# EAGLE design A500+ 2MB (EAGLE 7.6.0)
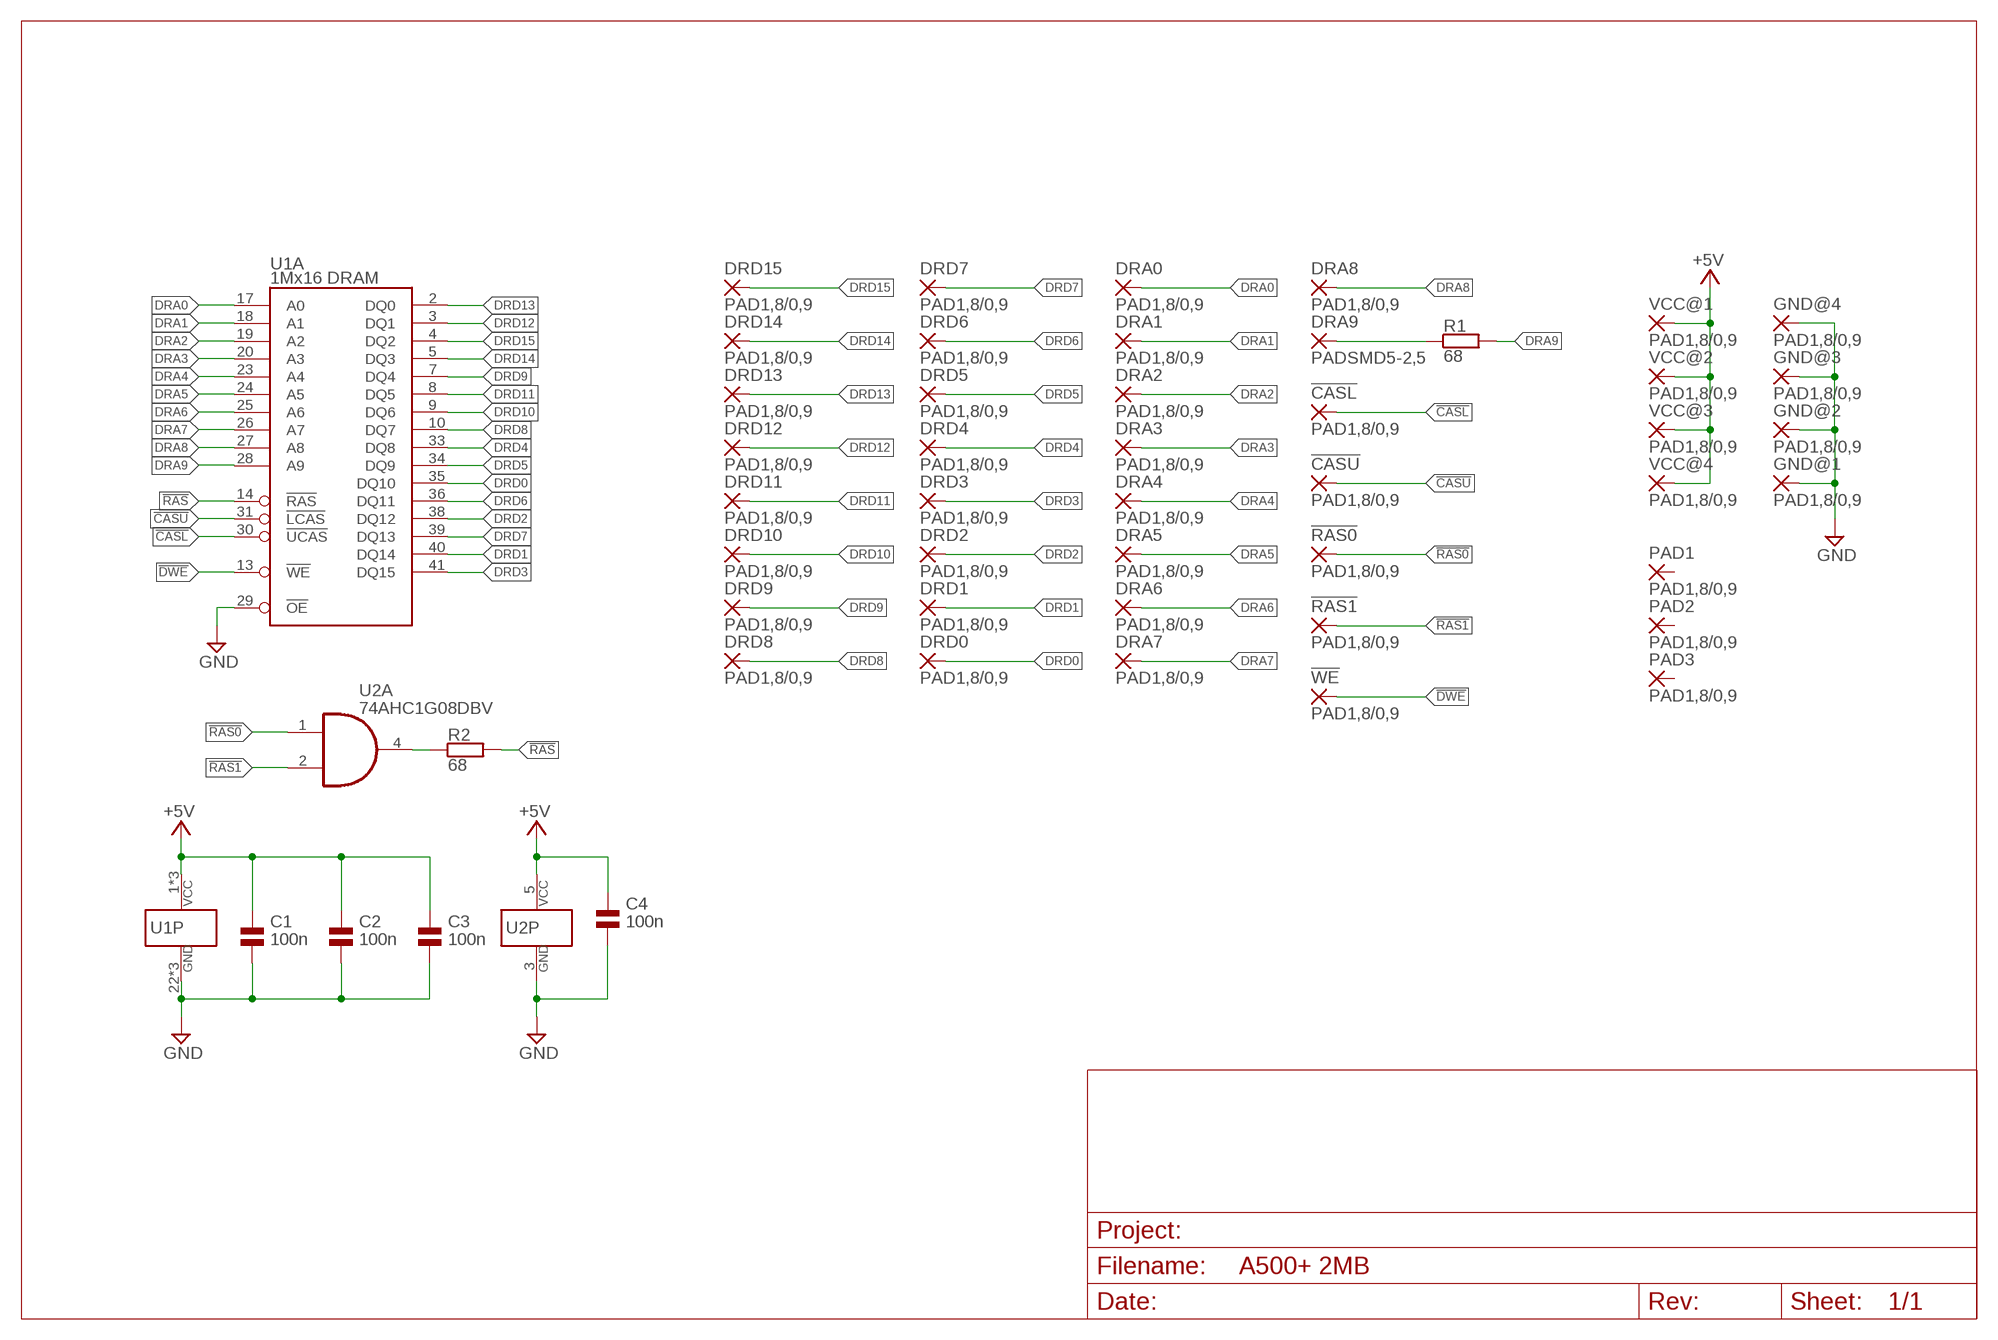
[diagram p0: schematic, sheet 1]

## Parts
!CASL  PAD1,8/0,9  [1,8/0,9]
!CASU  PAD1,8/0,9  [1,8/0,9]
!RAS0  PAD1,8/0,9  [1,8/0,9]
!RAS1  PAD1,8/0,9  [1,8/0,9]
!WE  PAD1,8/0,9  [1,8/0,9]
C1  100n  CAP_NPOL-0603  [0603]
C2  100n  CAP_NPOL-0603  [0603]
C3  100n  CAP_NPOL-0603  [0603]
C4  100n  CAP_NPOL-0603  [0603]
DRA0  PAD1,8/0,9  [1,8/0,9]
DRA1  PAD1,8/0,9  [1,8/0,9]
DRA2  PAD1,8/0,9  [1,8/0,9]
DRA3  PAD1,8/0,9  [1,8/0,9]
DRA4  PAD1,8/0,9  [1,8/0,9]
DRA5  PAD1,8/0,9  [1,8/0,9]
DRA6  PAD1,8/0,9  [1,8/0,9]
DRA7  PAD1,8/0,9  [1,8/0,9]
DRA8  PAD1,8/0,9  [1,8/0,9]
DRA9  PADSMD5-2,5  [5-2,5]
DRD0  PAD1,8/0,9  [1,8/0,9]
DRD1  PAD1,8/0,9  [1,8/0,9]
DRD2  PAD1,8/0,9  [1,8/0,9]
DRD3  PAD1,8/0,9  [1,8/0,9]
DRD4  PAD1,8/0,9  [1,8/0,9]
DRD5  PAD1,8/0,9  [1,8/0,9]
DRD6  PAD1,8/0,9  [1,8/0,9]
DRD7  PAD1,8/0,9  [1,8/0,9]
DRD8  PAD1,8/0,9  [1,8/0,9]
DRD9  PAD1,8/0,9  [1,8/0,9]
DRD10  PAD1,8/0,9  [1,8/0,9]
DRD11  PAD1,8/0,9  [1,8/0,9]
DRD12  PAD1,8/0,9  [1,8/0,9]
DRD13  PAD1,8/0,9  [1,8/0,9]
DRD14  PAD1,8/0,9  [1,8/0,9]
DRD15  PAD1,8/0,9  [1,8/0,9]
GND@1  PAD1,8/0,9  [1,8/0,9]
GND@2  PAD1,8/0,9  [1,8/0,9]
GND@3  PAD1,8/0,9  [1,8/0,9]
GND@4  PAD1,8/0,9  [1,8/0,9]
PAD1  PAD1,8/0,9  [1,8/0,9]
PAD2  PAD1,8/0,9  [1,8/0,9]
PAD3  PAD1,8/0,9  [1,8/0,9]
R1  68  RES-SMD_0603  [0603]
R2  68  RES-SMD_0603  [0603]
U1  1Mx16 DRAM  DRAM_1MX16-SOJ  [SOJ42/4]
U2  74AHC1G08DBV  [SOT23-5]
VCC@1  PAD1,8/0,9  [1,8/0,9]
VCC@2  PAD1,8/0,9  [1,8/0,9]
VCC@3  PAD1,8/0,9  [1,8/0,9]
VCC@4  PAD1,8/0,9  [1,8/0,9]

## Nets
!CASL: !CASL.1(P) U1.30(A:!UCAS)
!CASU: !CASU.1(P) U1.31(A:!LCAS)
!DWE: !WE.1(P) U1.13(A:!WE)
!RAS: R2.2 U1.14(A:!RAS)
!RAS0: !RAS0.1(P) U2.1(A:I0)
!RAS1: !RAS1.1(P) U2.2(A:I1)
+5V: C1.1 C2.1 C3.1 C4.1 U1.1(P:VCC) U1.6(P:VCC) U1.21(P:VCC) U2.5(P:VCC) VCC@1.1(P) VCC@2.1(P) VCC@3.1(P) VCC@4.1(P)
DRA0: DRA0.1(P) U1.17(A:A0)
DRA1: DRA1.1(P) U1.18(A:A1)
DRA2: DRA2.1(P) U1.19(A:A2)
DRA3: DRA3.1(P) U1.20(A:A3)
DRA4: DRA4.1(P) U1.23(A:A4)
DRA5: DRA5.1(P) U1.24(A:A5)
DRA6: DRA6.1(P) U1.25(A:A6)
DRA7: DRA7.1(P) U1.26(A:A7)
DRA8: DRA8.1(P) U1.27(A:A8)
DRA9: R1.2 U1.28(A:A9)
DRA9_: DRA9.1(P) R1.1
DRD0: DRD0.1(P) U1.35(A:DQ10)
DRD1: DRD1.1(P) U1.40(A:DQ14)
DRD2: DRD2.1(P) U1.38(A:DQ12)
DRD3: DRD3.1(P) U1.41(A:DQ15)
DRD4: DRD4.1(P) U1.33(A:DQ8)
DRD5: DRD5.1(P) U1.34(A:DQ9)
DRD6: DRD6.1(P) U1.36(A:DQ11)
DRD7: DRD7.1(P) U1.39(A:DQ13)
DRD8: DRD8.1(P) U1.10(A:DQ7)
DRD9: DRD9.1(P) U1.7(A:DQ4)
DRD10: DRD10.1(P) U1.9(A:DQ6)
DRD11: DRD11.1(P) U1.8(A:DQ5)
DRD12: DRD12.1(P) U1.3(A:DQ1)
DRD13: DRD13.1(P) U1.2(A:DQ0)
DRD14: DRD14.1(P) U1.5(A:DQ3)
DRD15: DRD15.1(P) U1.4(A:DQ2)
GND: C1.2 C2.2 C3.2 C4.2 GND@1.1(P) GND@2.1(P) GND@3.1(P) GND@4.1(P) U1.22(P:GND) U1.29(A:!OE) U1.37(P:GND) U1.42(P:GND) U2.3(P:GND)
N$1: R2.1 U2.4(A:O)
Unconnected: PAD1.1(P) PAD2.1(P) PAD3.1(P)

## Library data of the parts
!CASL !CASU !RAS0 !RAS1 !WE DRA0 DRA1-DRA9 DRD0 DRD1-DRD15 GND@1-GND@4 PAD1-PAD3 VCC@1-VCC@4 = jc-connectors:PAD: Wire PAD connect wire on PCB
C1-C4 = jc-passive:CAP_NPOL
R1 R2 = jc-passive:RES
U1 = jc-memories:DRAM_1MX16
U2 = jc-logic:74*1G08

## Board
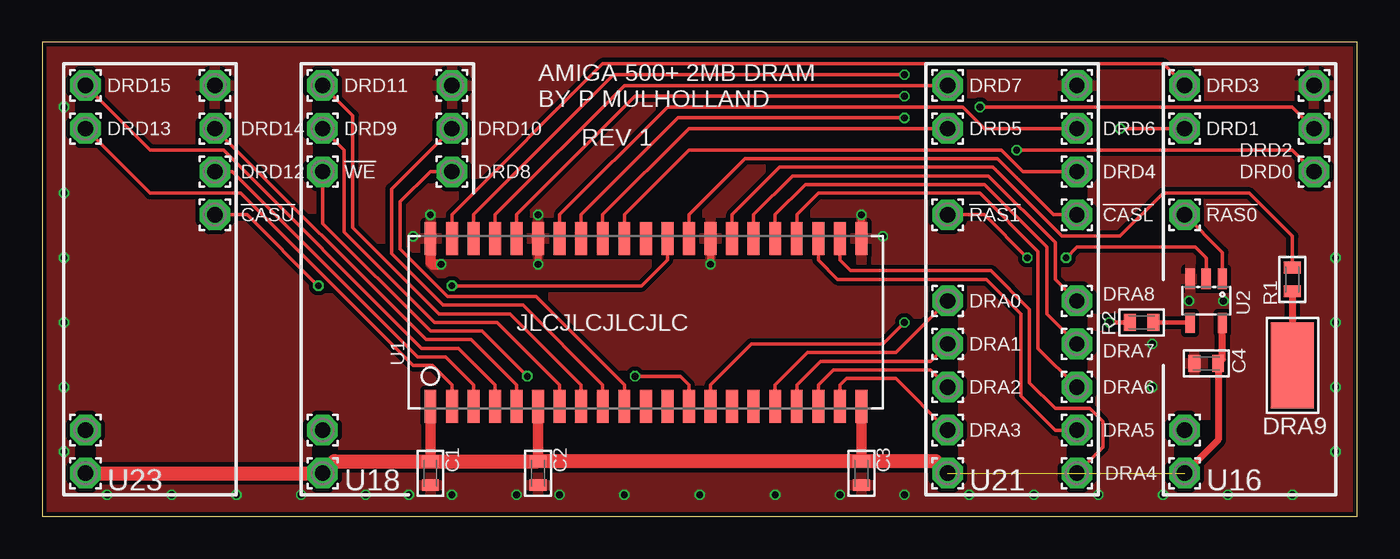
[diagram p1: board, top side]
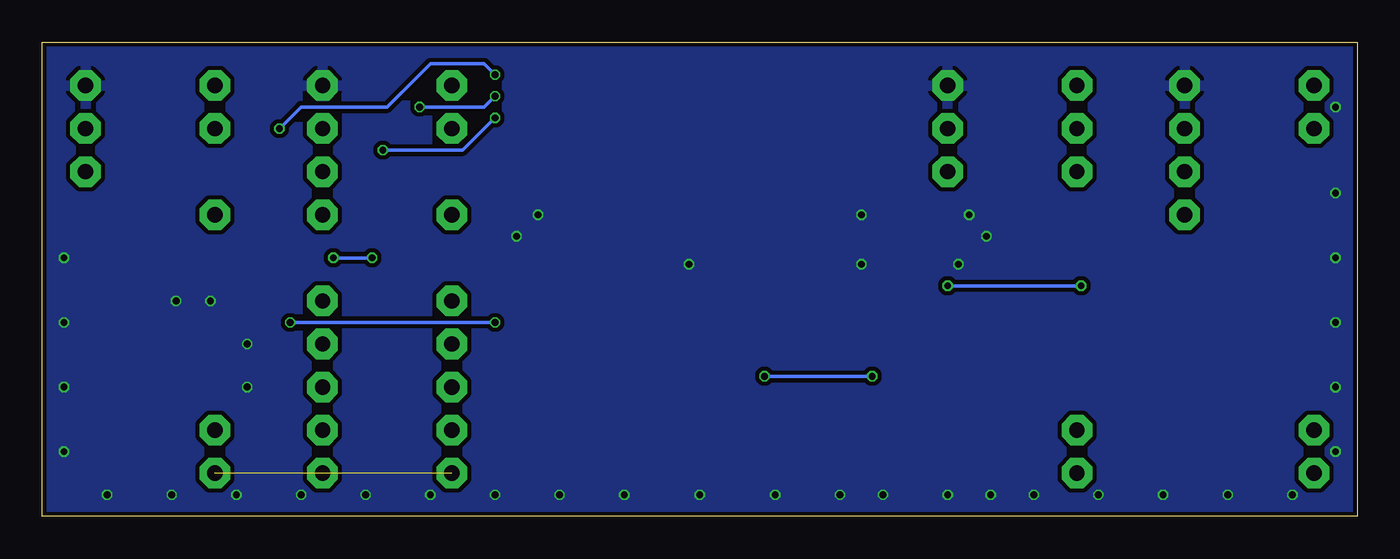
[diagram p2: board, bottom side, seen from below]

Size 77.47 x 27.94 mm. Coordinates in mm from the lower left corner, seen from the top.
Outline: 0,0 77.47,0 77.47,27.94 0,27.94 0,0
Copper layers (1*16): Top 0.035mm / dielectric 0.2mm / Bottom 0.035mm
Design rules "jlcpcb-2layers": minimum track width 3.5mil, minimum drill 0.2mm, track to track 5mil, track to pad 5mil, pad to pad 5mil, via to via 5mil, smd to smd 0mil, copper to edge 0.1mm, drill to drill 5mil, minimum pad ring 4mil, minimum via ring 4mil, stop-mask expansion 3mil, vias tented up to drill 100mil, thermal gap 10mil

### Footprints (pad centres in the part's own frame; a part is rotated, then mirrored left to right if it is on the bottom)
1,8/0,9 = drill 0.9 pad 1.8 octagon: 1 0,0
0603 = smd 0.7 x 1: 1 -0.7,0; 2 0.7,0
5-2,5 = smd 2.54 x 5.08: 1 0,0
SOJ42/4 = smd 0.7 x 1.95: 1 -12.7,-4.95; 2 -11.43,-4.95; 3 -10.16,-4.95; 4 -8.89,-4.95; 5 -7.62,-4.95; 6 -6.35,-4.95; 7 -5.08,-4.95; 8 -3.81,-4.95; 9 -2.54,-4.95; 10 -1.27,-4.95; 11 0,-4.95; 12 1.27,-4.95; 13 2.54,-4.95; 14 3.81,-4.95; 15 5.08,-4.95; 16 6.35,-4.95; 17 7.62,-4.95; 18 8.89,-4.95; 19 10.16,-4.95; 20 11.43,-4.95; 21 12.7,-4.95; 22 12.7,4.95; 23 11.43,4.95; 24 10.16,4.95; 25 8.89,4.95; 26 7.62,4.95; 27 6.35,4.95; 28 5.08,4.95; 29 3.81,4.95; 30 2.54,4.95; 31 1.27,4.95; 32 0,4.95; 33 -1.27,4.95; 34 -2.54,4.95; 35 -3.81,4.95; 36 -5.08,4.95; 37 -6.35,4.95; 38 -7.62,4.95; 39 -8.89,4.95; 40 -10.16,4.95; 41 -11.43,4.95; 42 -12.7,4.95
SOT23-5 = smd 0.55 x 1.2: 1 -0.95,-1.3; 2 0,-1.3; 3 0.95,-1.3; 4 0.95,1.3; 5 -0.95,1.3

### Placement (x,y rotation side)
!CASL  60.96,17.78 0 top
!CASU  10.16,17.78 0 top
!RAS0  67.31,17.78 0 top
!RAS1  53.34,17.78 0 top
!WE  16.51,20.32 0 top
C1  22.86,2.54 270 top
C2  29.21,2.54 270 top
C3  48.26,2.54 270 top
C4  68.58,9.02 180 top
DRA0  53.34,12.7 0 top
DRA1  53.34,10.16 0 top
DRA2  53.34,7.62 0 top
DRA3  53.34,5.08 0 top
DRA4  60.96,2.54 0 top
DRA5  60.96,5.08 0 top
DRA6  60.96,7.62 0 top
DRA7  60.96,10.16 0 top
DRA8  60.96,12.7 0 top
DRA9  73.66,8.89 0 top
DRD0  74.93,20.32 0 top
DRD1  67.31,22.86 0 top
DRD2  74.93,22.86 0 top
DRD3  67.31,25.4 0 top
DRD4  60.96,20.32 0 top
DRD5  53.34,22.86 0 top
DRD6  60.96,22.86 0 top
DRD7  53.34,25.4 0 top
DRD8  24.13,20.32 0 top
DRD9  16.51,22.86 0 top
DRD10  24.13,22.86 0 top
DRD11  16.51,25.4 0 top
DRD12  10.16,20.32 0 top
DRD13  2.54,22.86 0 top
DRD14  10.16,22.86 0 top
DRD15  2.54,25.4 0 top
GND@1  10.16,25.4 0 top
GND@2  24.13,25.4 0 top
GND@3  60.96,25.4 0 top
GND@4  74.93,25.4 0 top
PAD1  2.54,5.08 0 top
PAD2  16.51,5.08 0 top
PAD3  67.31,5.08 0 top
R1  73.66,13.97 90 top
R2  64.77,11.43 180 top
U1  35.56,11.43 0 top
U2  68.58,12.7 180 top
VCC@1  53.34,2.54 0 top
VCC@2  2.54,2.54 0 top
VCC@3  67.31,2.54 0 top
VCC@4  16.51,2.54 0 top

### Tracks (layer width: path | path; a pad name or v marks a point on that pad's centre or on a via)
!CASL
  Top 0.203: !CASL.1 59.56,17.78 56.26,21.08 41.4,21.08 38.1,17.78 U1.30
!CASU  (via drill 0.4)
  Top 0.203: U1.31 36.83,15.11 35.31,13.59 v24.13,13.59 | !CASU.1 12.06,17.78 v16.26,13.59
  Bottom 0.203: v16.26,13.59 v24.13,13.59
!DWE  (via drill 0.4)
  Top 0.203: U1.13 38.1,7.75 37.59,8.26 v34.92,8.26 | v28.57,8.26 25.91,10.92 22.86,10.92 16.51,17.27 !WE.1
  Bottom 0.203: v34.92,8.26 v28.57,8.26
!RAS  (via drill 0.4)
  Top 0.203: U1.14 39.37,7.75 41.78,10.16 49.53,10.16 v50.8,11.43
  Top 0.254: R2.2 v62.87,11.43
  Bottom 0.203: v50.8,11.43 v62.87,11.43
!RAS0
  Top 0.203: U2.1 69.53,15.56 !RAS0.1
!RAS1  (via drill 0.4)
  Top 0.203: !RAS1.1 55.5,17.78 v58.04,15.24 | U2.2 68.58,15.24 67.94,15.88 60.96,15.88 v60.33,15.24
  Bottom 0.203: v58.04,15.24 v60.33,15.24
+5V  (1 unrouted)
  Top 0.406: U2.5 69.53,9.27 C4.1 69.28,4.51 VCC@3.1
  Top 0.61: U1.1 C1.1 | U1.6 C2.1 | U1.21 C3.1
  Top 0.813: VCC@2.1 VCC@4.1 17.21,3.24 C1.1 C2.1 C3.1 52.64,3.24 VCC@1.1
DRA0
  Top 0.203: U1.17 43.18,7.75 45.09,9.65 50.29,9.65 DRA0.1
DRA1
  Top 0.203: U1.18 44.45,7.75 45.85,9.14 52.32,9.14 DRA1.1
DRA2
  Top 0.203: U1.19 45.72,7.75 46.61,8.64 52.32,8.64 DRA2.1
DRA3
  Top 0.203: U1.20 46.99,7.75 47.37,8.13 50.29,8.13 DRA3.1
DRA4
  Top 0.203: U1.23 46.99,15.11 47.62,14.48 55.88,14.48 58.17,12.19 58.17,7.87 59.69,6.35 61.72,6.35 62.48,5.59 62.48,4.06 DRA4.1
DRA5
  Top 0.203: U1.24 45.72,15.11 46.86,13.97 55.63,13.97 57.66,11.94 57.66,7.11 59.69,5.08 DRA5.1
DRA6
  Top 0.203: U1.25 44.45,17.78 45.72,19.05 55.24,19.05 58.67,15.62 58.67,9.91 DRA6.1
DRA7
  Top 0.203: U1.26 43.18,17.78 44.96,19.56 55.5,19.56 59.18,15.88 59.18,11.94 DRA7.1
DRA8
  Top 0.203: DRA8.1 59.69,13.97 59.69,16.13 55.75,20.07 44.2,20.07 41.91,17.78 U1.27
DRA9
  Top 0.203: U1.28 40.64,17.78 43.43,20.57 56.01,20.57 60.07,16.51 63.5,16.51 66.04,19.05 71.12,19.05 73.66,16.51 R1.2
DRA9_
  Top 0.406: R1.1 DRA9.1
DRD0  (via drill 0.4)
  Top 0.203: DRD0.1 73.66,21.59 v57.4,21.59 | v50.8,23.5 37.47,23.5 31.75,17.78 U1.35
  Bottom 0.203: v57.4,21.59 52.7,21.59 v50.8,23.5
DRD1  (via drill 0.4)
  Top 0.203: DRD1.1 v63.5,22.86 | U1.40 25.4,17.78 33.66,26.04 v50.8,26.04
  Bottom 0.203: v63.5,22.86 62.23,24.13 57.15,24.13 54.61,26.67 51.44,26.67 v50.8,26.04
DRD2  (via drill 0.4)
  Top 0.203: DRD2.1 73.66,24.13 v55.24,24.13 | v50.8,24.77 34.92,24.77 27.94,17.78 U1.38
  Bottom 0.203: v55.24,24.13 51.44,24.13 v50.8,24.77
DRD3
  Top 0.203: DRD3.1 66.04,26.67 33.02,26.67 24.13,17.78 U1.41
DRD4
  Top 0.203: DRD4.1 57.78,20.32 56.52,21.59 38.1,21.59 34.29,17.78 U1.33
DRD5
  Top 0.203: DRD5.1 38.1,22.86 33.02,17.78 U1.34
DRD6
  Top 0.203: DRD6.1 55.5,22.86 54.23,24.13 36.83,24.13 30.48,17.78 U1.36
DRD7
  Top 0.203: DRD7.1 34.29,25.4 26.67,17.78 U1.39
DRD8
  Top 0.203: U1.10 34.29,7.75 29.08,12.95 23.88,12.95 21.08,15.75 21.08,18.54 22.86,20.32 DRD8.1
DRD9
  Top 0.203: DRD9.1 17.78,21.59 17.78,16.76 23.11,11.43 26.8,11.43 30.48,7.75 U1.7
DRD10
  Top 0.203: U1.9 33.02,7.75 28.32,12.45 23.62,12.45 20.57,15.49 20.57,19.3 DRD10.1
DRD11
  Top 0.203: U1.8 31.75,7.75 27.56,11.94 23.37,11.94 18.29,17.02 18.29,23.62 DRD11.1
DRD12
  Top 0.203: U1.3 25.4,7.75 23.75,9.4 22.1,9.4 11.18,20.32 DRD12.1
DRD13
  Top 0.203: U1.2 24.13,7.75 22.99,8.89 21.84,8.89 11.68,19.05 6.35,19.05 DRD13.1
DRD14
  Top 0.203: U1.5 27.94,7.75 25.27,10.41 22.61,10.41 DRD14.1
DRD15
  Top 0.203: DRD15.1 6.35,21.59 10.67,21.59 22.35,9.91 24.51,9.91 26.67,7.75 U1.4
GND  (via drill 0.4)
  Top 0.406: U1.37 v29.21,14.86 | U1.22 v48.26,17.78 | U1.29 v39.37,14.86
  Top 0.61: U1.42 22.86,14.99 22.99,14.86 v23.5,14.86
  other vias: 49.53,16.51 29.21,17.78 1.27,7.62 1.27,11.43 1.27,15.24 1.27,19.05 76.2,3.81 76.2,7.62 76.2,11.43 76.2,15.24 65.41,7.62 69.6,12.7 67.56,12.7 65.41,10.16 24.13,1.27 27.94,1.27 30.48,1.27 46.99,1.27 21.59,1.27 34.29,1.27 38.73,1.27 43.18,1.27 62.23,1.27 66.04,1.27 73.66,1.27 69.85,1.27 19.05,1.27 15.24,1.27 11.43,1.27 7.62,1.27 3.81,1.27 58.42,1.27 54.61,1.27 50.8,1.27 1.27,3.81 1.27,24.13 22.86,17.78 21.84,16.51
  pour Bottom (isolate 0.254): 0,0 77.47,0 77.47,27.94 0,27.94
  pour Top (isolate 0.254): 0,0 77.47,0 77.47,27.94 0,27.94
N$1
  Top 0.254: R2.1 67.63,11.43 U2.4

### Text on the board
tPlace: AMIGA 500+ 2MB DRAM / BY P MULHOLLAND | REV 1 | JLCJLCJLCJLC | U23 | U18 | U21 | U16